# EAGLE design Phono-v1 (EAGLE 7.6.0)
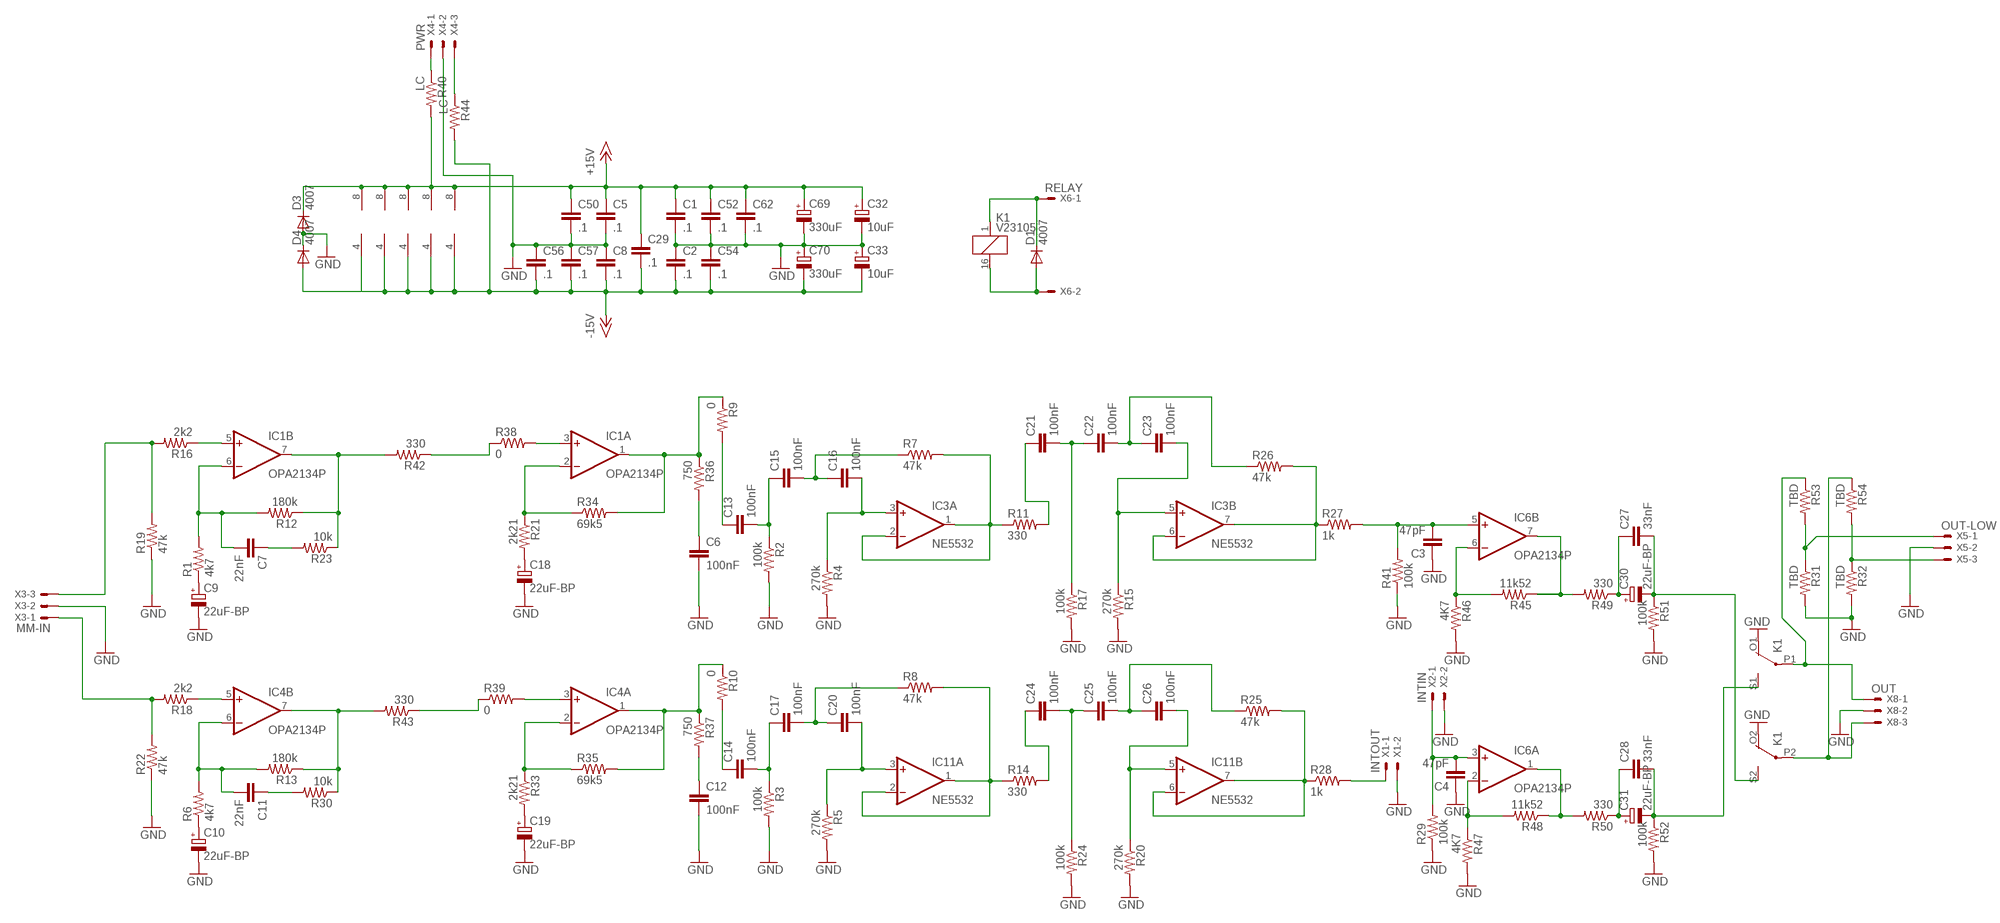
[diagram p0: schematic, sheet 1]

## Parts
C1  .1  C-EUC4532  [C4532]
C2  .1  C-EUC4532  [C4532]
C3  47pF  C-EUC1210  [C1210]
C4  47pF  C-EUC1210  [C1210]
C5  .1  C-EUC4532  [C4532]
C6  100nF  C-EU050-075X075  [C050-075X075]
C7  22nF  C-EU050-075X075  [C050-075X075]
C8  .1  C-EUC4532  [C4532]
C9  22uF-BP  CPOL-EUE5-10.5  [E5-10,5]
C10  22uF-BP  CPOL-EUE5-10.5  [E5-10,5]
C11  22nF  C-EU050-075X075  [C050-075X075]
C12  100nF  C-EU050-075X075  [C050-075X075]
C13  100nF  C-EU050-075X075  [C050-075X075]
C14  100nF  C-EU050-075X075  [C050-075X075]
C15  100nF  C-EU050-075X075  [C050-075X075]
C16  100nF  C-EU050-075X075  [C050-075X075]
C17  100nF  C-EU050-075X075  [C050-075X075]
C18  22uF-BP  CPOL-EUE5-10.5  [E5-10,5]
C19  22uF-BP  CPOL-EUE5-10.5  [E5-10,5]
C20  100nF  C-EU050-075X075  [C050-075X075]
C21  100nF  C-EU050-075X075  [C050-075X075]
C22  100nF  C-EU050-075X075  [C050-075X075]
C23  100nF  C-EU050-075X075  [C050-075X075]
C24  100nF  C-EU050-075X075  [C050-075X075]
C25  100nF  C-EU050-075X075  [C050-075X075]
C26  100nF  C-EU050-075X075  [C050-075X075]
C27  33nF  C-EU050-075X075  [C050-075X075]
C28  33nF  C-EU050-075X075  [C050-075X075]
C29  .1  C-EUC4532  [C4532]
C30  22uF-BP  CPOL-EUE5-10.5  [E5-10,5]
C31  22uF-BP  CPOL-EUE5-10.5  [E5-10,5]
C32  10uF  CPOL-EUE2-5  [E2-5]
C33  10uF  CPOL-EUE2-5  [E2-5]
C50  .1  C-EUC4532  [C4532]
C52  .1  C-EUC4532  [C4532]
C54  .1  C-EUC4532  [C4532]
C56  .1  C-EUC4532  [C4532]
C57  .1  C-EUC4532  [C4532]
C62  .1  C-EUC4532  [C4532]
C69  330uF  CPOL-EUE5-10.5  [E5-10,5]
C70  330uF  CPOL-EUE5-10.5  [E5-10,5]
D1  4007  1N4148DO35-7  [DO35-7]
D3  4007  1N4148DO35-10  [DO35-10]
D4  4007  1N4148DO35-10  [DO35-10]
IC1  OPA2134P  [DIL08]
IC3  NE5532  OPA2134P  [DIL08]
IC4  OPA2134P  [DIL08]
IC6  OPA2134P  [DIL08]
IC11  NE5532  OPA2134P  [DIL08]
K1  V23105  351  [351]
R1  4k7  R-US_0309/10  [0309/10]
R2  100k  R-US_0309/10  [0309/10]
R3  100k  R-US_0309/10  [0309/10]
R4  270k  R-US_0309/10  [0309/10]
R5  270k  R-US_0309/10  [0309/10]
R6  4k7  R-US_0309/10  [0309/10]
R7  47k  R-US_0309/10  [0309/10]
R8  47k  R-US_0309/10  [0309/10]
R9  0  R-US_0309/10  [0309/10]
R10  0  R-US_0309/12  [0309/12]
R11  330  R-US_0309/10  [0309/10]
R12  180k  R-US_0309/10  [0309/10]
R13  180k  R-US_0309/10  [0309/10]
R14  330  R-US_0309/10  [0309/10]
R15  270k  R-US_0309/10  [0309/10]
R16  2k2  R-US_0309/10  [0309/10]
R17  100k  R-US_0309/10  [0309/10]
R18  2k2  R-US_0309/10  [0309/10]
R19  47k  R-US_0309/10  [0309/10]
R20  270k  R-US_0309/10  [0309/10]
R21  2k21  R-US_0309/10  [0309/10]
R22  47k  R-US_0309/10  [0309/10]
R23  10k  R-US_0309/10  [0309/10]
R24  100k  R-US_0309/10  [0309/10]
R25  47k  R-US_0309/10  [0309/10]
R26  47k  R-US_0309/10  [0309/10]
R27  1k  R-US_0309/10  [0309/10]
R28  1k  R-US_0309/12  [0309/12]
R29  100k  R-US_0309/10  [0309/10]
R30  10k  R-US_0309/10  [0309/10]
R31  TBD  R-US_0309/10  [0309/10]
R32  TBD  R-US_0309/10  [0309/10]
R33  2k21  R-US_0309/10  [0309/10]
R34  69k5  R-US_0309/10  [0309/10]
R35  69k5  R-US_0309/10  [0309/10]
R36  750  R-US_0309/10  [0309/10]
R37  750  R-US_0309/10  [0309/10]
R38  0  R-US_0207/7  [0207/7]
R39  0  R-US_0204/7  [0204/7]
R40  LC  R-US_0309/12  [0309/12]
R41  100k  R-US_0309/10  [0309/10]
R42  330  R-US_0309/10  [0309/10]
R43  330  R-US_0309/10  [0309/10]
R44  LC  R-US_0309/12  [0309/12]
R45  11k52  R-US_0309/10  [0309/10]
R46  4K7  R-US_0309/10  [0309/10]
R47  4K7  R-US_0309/10  [0309/10]
R48  11k52  R-US_0309/10  [0309/10]
R49  330  R-US_0309/10  [0309/10]
R50  330  R-US_0309/10  [0309/10]
R51  100k  R-US_0309/10  [0309/10]
R52  100k  R-US_0309/10  [0309/10]
R53  TBD  R-US_0309/10  [0309/10]
R54  TBD  R-US_0309/10  [0309/10]
X1  INTOUT  22-23-2021  [22-23-2021]
X2  INTIN  22-23-2021  [22-23-2021]
X3  MM-IN  22-23-2031  [22-23-2031]
X4  PWR  22-23-2031  [22-23-2031]
X5  OUT-LOW  22-23-2031  [22-23-2031]
X6  RELAY  22-23-2021  [22-23-2021]
X8  OUT  22-23-2031  [22-23-2031]

## Nets
+15V: C1.1 C5.1 C29.1 C32.+ C50.1 C52.1 C62.1 C69.+ D3.C IC1.8(P:V+) IC3.8(P:V+) IC4.8(P:V+) IC6.8(P:V+) IC11.8(P:V+) R40.2
-15V: C2.2 C8.2 C29.2 C33.- C54.2 C56.2 C57.2 C70.- D4.A IC1.4(P:V-) IC3.4(P:V-) IC4.4(P:V-) IC6.4(P:V-) IC11.4(P:V-) R44.2
GND: C1.2 C2.1 C3.1 C4.1 C5.2 C6.2 C8.1 C9.- C10.- C12.2 C18.- C19.- C32.- C33.+ C50.2 C52.2 C54.1 C56.1 C57.1 C62.2 C69.- C70.+ D3.A D4.C K1.O1(2:O) K1.O2(3:O) R2.2 R3.2 R4.2 R5.2 R15.2 R17.2 R19.1 R20.2 R22.1 R24.2 R29.1 R31.2 R32.2 R41.1 R46.2 R47.2 R51.2 R52.2 X1.2 X2.2 X3.2 X4.2 X5.2 X8.2
N$1: C13.2 C15.1 R2.1
N$2: C14.2 C17.1 R3.1
N$3: R31.1 R53.2 X5.1
N$4: C13.1 R9.2
N$5: C14.1 R10.2
N$6: IC3.6(B:-IN) IC3.7(B:OUT) R26.2 R27.1
N$7: IC11.1(A:OUT) IC11.2(A:-IN) R8.2 R14.1
N$8: IC11.6(B:-IN) IC11.7(B:OUT) R25.2 R28.1
N$9: C26.2 IC11.5(B:+IN) R20.1
N$10: R39.1 R43.1
N$11: R38.1 R42.1
N$12: C23.2 IC3.5(B:+IN) R15.1
N$13: C16.2 IC3.3(A:+IN) R4.1
N$14: IC1.5(B:+IN) R16.1
N$15: C17.2 C20.1 R8.1
N$16: C21.1 R11.2
N$17: C15.2 C16.1 R7.1
N$18: IC4.5(B:+IN) R18.1
N$19: IC1.7(B:OUT) R12.1 R23.1 R42.2
N$20: IC4.7(B:OUT) R13.1 R30.1 R43.2
N$21: C11.2 IC4.6(B:-IN) R6.2 R13.2
N$22: C7.2 IC1.6(B:-IN) R1.2 R12.2
N$23: R18.2 R22.2 X3.1
N$24: C20.2 IC11.3(A:+IN) R5.1
N$25: C24.1 R14.2
N$26: C21.2 C22.1 R17.1
N$27: C22.2 C23.1 R26.1
N$28: C24.2 C25.1 R24.1
N$29: R16.2 R19.2 X3.3
N$30: IC1.2(A:-IN) R21.1 R34.1
N$31: IC4.2(A:-IN) R33.1 R35.1
N$32: K1.P2(3:P) R54.1 X8.3
N$33: K1.P1(2:P) R53.1 X8.1
N$34: C7.1 R23.2
N$36: C9.+ R1.1
N$37: IC1.3(A:+IN) R38.2
N$38: IC1.1(A:OUT) R9.1 R34.2 R36.1
N$39: D1.A K1.16 X6.2
N$40: D1.C K1.1 X6.1
N$41: IC4.1(A:OUT) R10.1 R35.2 R37.1
N$42: C6.1 R36.2
N$43: C12.1 R37.2
N$44: C18.+ R21.2
N$45: C19.+ R33.2
N$46: IC4.3(A:+IN) R39.2
N$47: C10.+ R6.1
N$48: C25.2 C26.1 R25.1
N$49: IC3.1(A:OUT) IC3.2(A:-IN) R7.2 R11.1
N$50: C11.1 R30.2
N$51: C3.2 IC6.5(B:+IN) R27.2 R41.2
N$52: R28.2 X1.1
N$53: C4.2 IC6.3(A:+IN) R29.2 X2.1
N$54: R40.1 X4.1
N$55: R44.1 X4.3
N$56: IC6.6(B:-IN) R45.2 R46.1
N$57: C28.2 C31.- K1.S1(2:S) R52.1
N$58: C27.1 C30.+ R49.1
N$59: IC6.2(A:-IN) R47.1 R48.2
N$60: C28.1 C31.+ R50.1
N$61: C27.2 C30.- K1.S2(3:S) R51.1
N$62: IC6.7(B:OUT) R45.1 R49.2
N$63: IC6.1(A:OUT) R48.1 R50.2
N$64: R32.1 R54.2 X5.3

## Library data of the parts
C1-C8 C11-C17 C20-C29 C50 C52 C54 C56 C57 C62 = resistor:C-EU: CAPACITOR, European symbol
C9 C10 C18 C19 C30-C33 C69 C70 = resistor:CPOL-EU: POLARIZED CAPACITOR, European symbol
D1 D3 D4 = diode:1N4148: DIODE high speed (Philips)
IC1 IC3 IC4 IC6 IC11 = linear:OPA2134: SoundPLUS (TM) High Performance AUDIO OPERATIONAL AMPLIFIERS Source: http://focus.ti.com/lit/ds/sbos058/sbos058.pdf
K1 = relay:351: RELAY 2 x switch, Omron; OC_FARNELL: unknown; OC_NEWARK: unknown
R1-R54 = resistor:R-US_: RESISTOR, American symbol
X1 X2 X6 = con-molex:22-23-2021: .100" (2.54mm) Center Header - 2 Pin; MF: MOLEX; MPN: 22-23-2021; OC_FARNELL: 1462926; OC_NEWARK: 25C3832
X3-X5 X8 = con-molex:22-23-2031: .100" (2.54mm) Center Header - 3 Pin; MF: MOLEX; MPN: 22-23-2031; OC_FARNELL: 1462950; OC_NEWARK: 30C0862

## Board
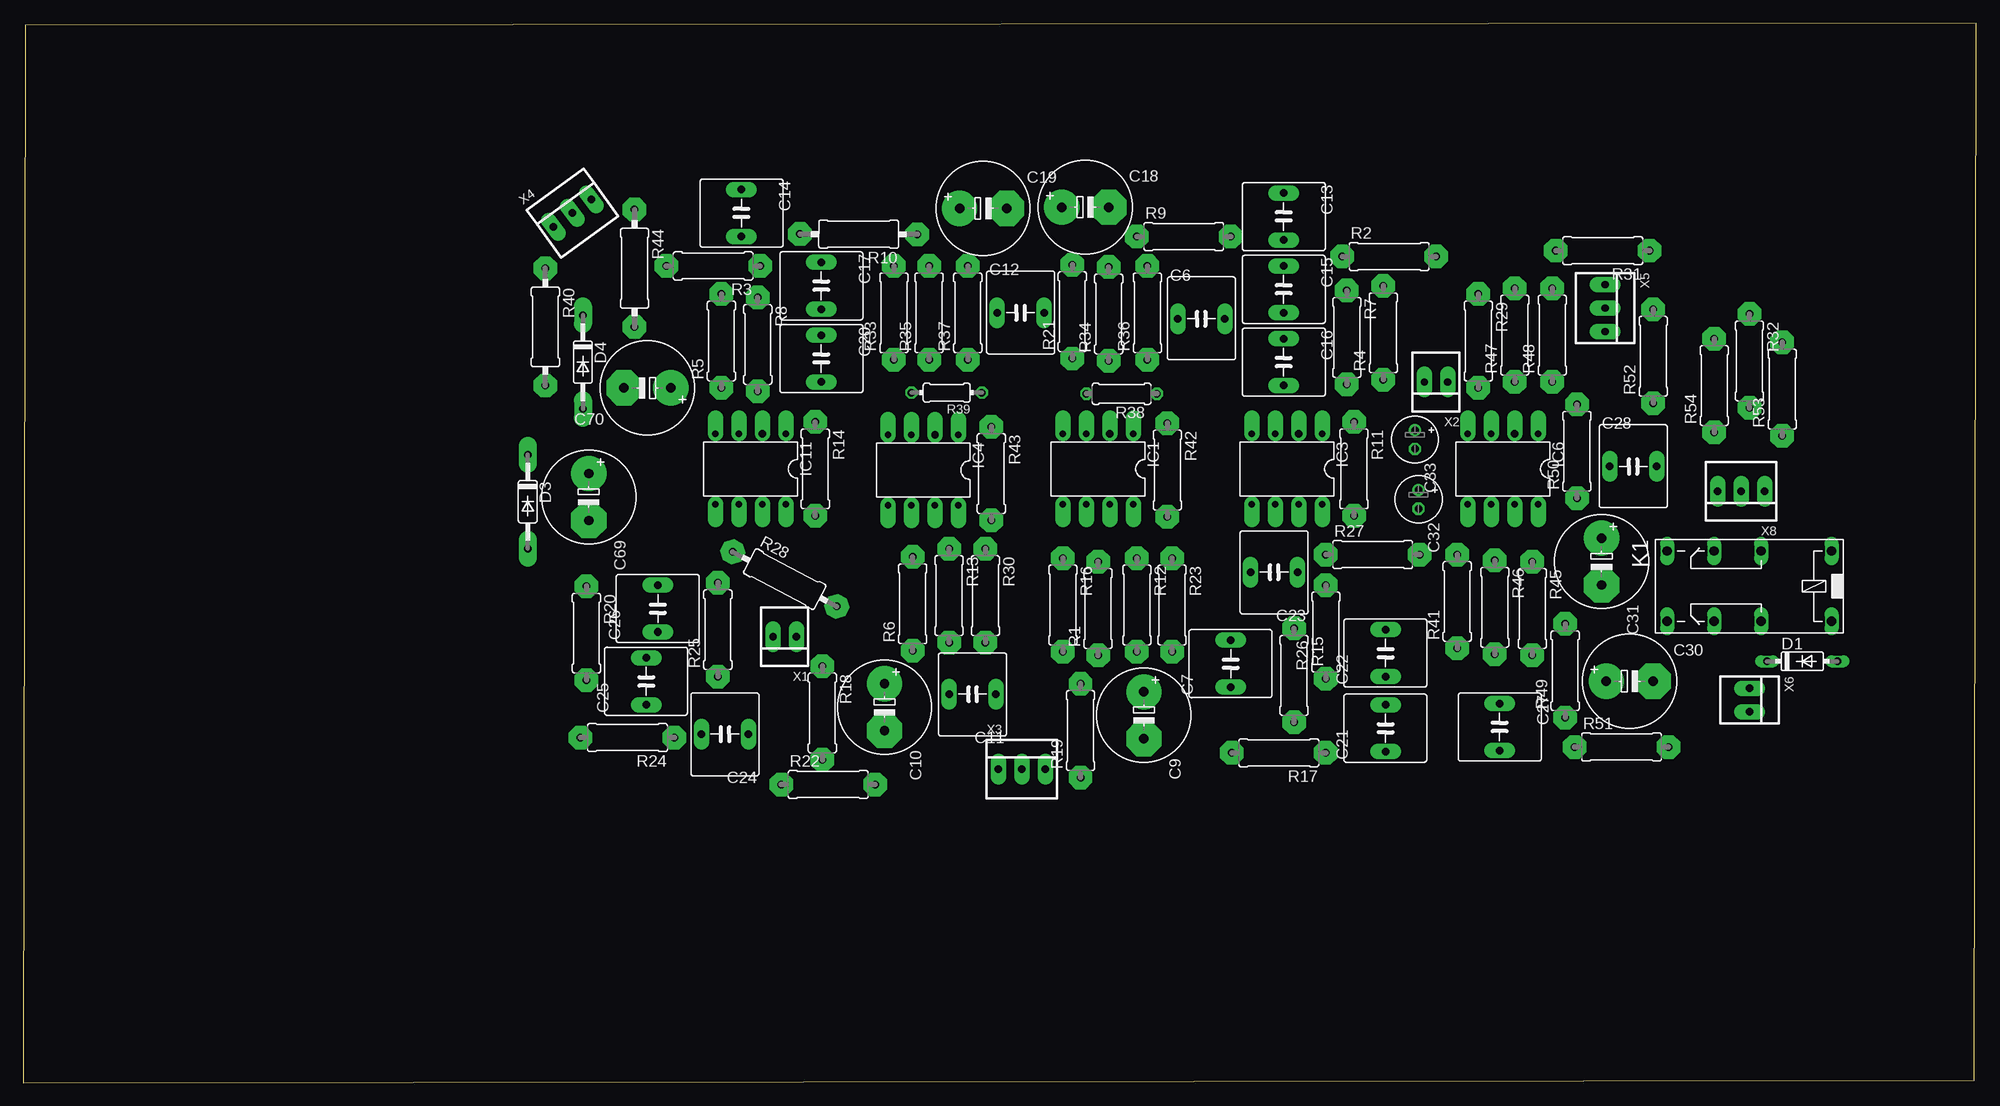
[diagram p1: board, top side]
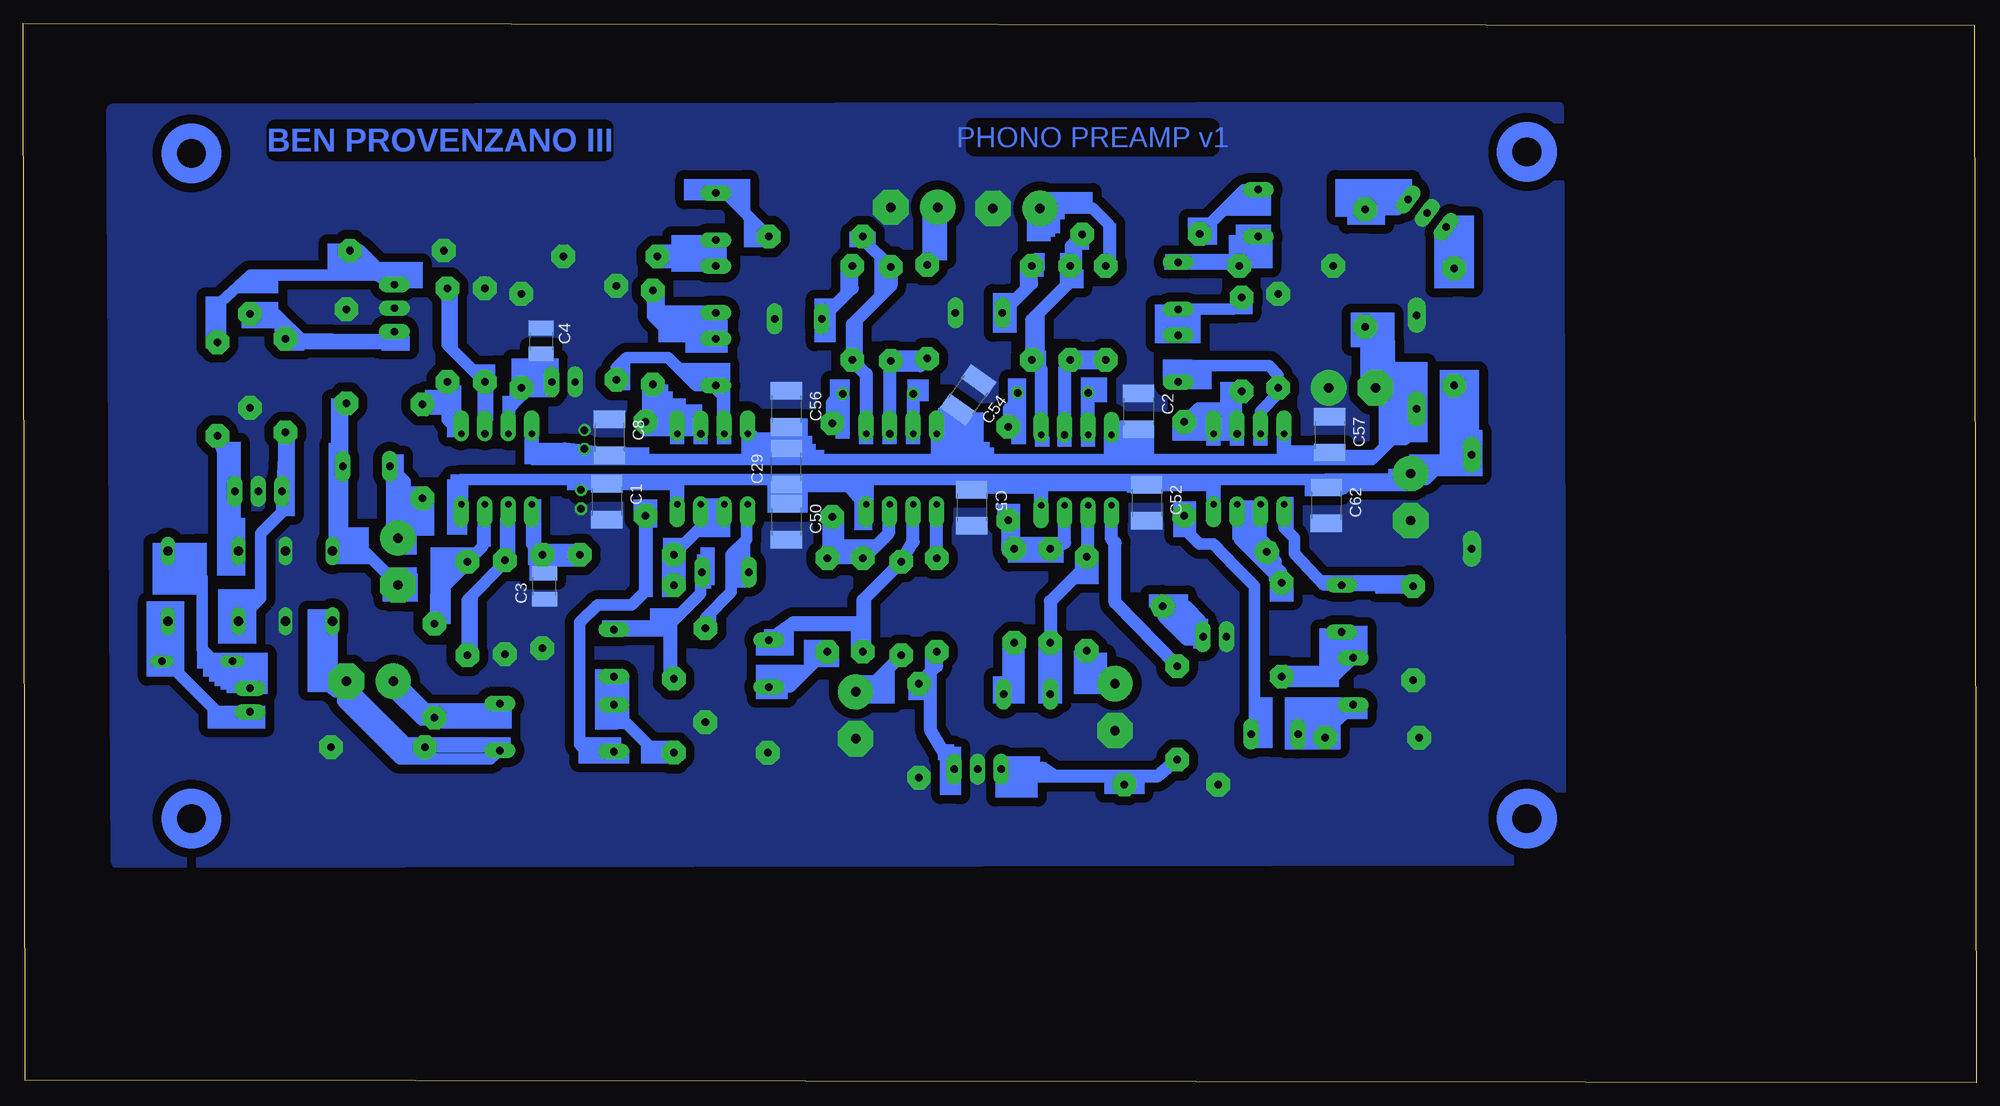
[diagram p2: board, bottom side, seen from below]

Size 211.38 x 114.67 mm. Coordinates in mm from the lower left corner, seen from the top.
Outline: 0,0 211.12,0.25 211.38,114.67 0.25,114.42 0,0
Copper layers (1*16): Top 0.035mm / dielectric 1.5mm / Bottom 0.035mm
Design rules "default": minimum track width 10mil, minimum drill 24mil, track to track 8mil, track to pad 8mil, pad to pad 8mil, via to via 8mil, smd to smd 8mil, copper to edge 40mil, drill to drill 8mil, minimum pad ring 10mil, minimum via ring 8mil, stop-mask expansion 5mil, vias tented up to drill 0mil, thermal gap 10mil

### Footprints (pad centres in the part's own frame; a part is rotated, then mirrored left to right if it is on the bottom)
C4532 = smd 1.9 x 3.4: 1 -1.95,0; 2 1.95,0
C1210 = smd 1.6 x 2.7: 1 -1.4,0; 2 1.4,0
C050-075X075 = drill 0.813 pad 1.676 long: 1 -2.54,0; 2 2.54,0
E5-10,5 = drill 1.016 pad 3.81: + -2.54,0 | drill 1.016 pad 3.81 octagon: - 2.54,0
E2-5 = drill 0.813 pad 1.27: + -1.016,0 | drill 0.813 pad 1.27 octagon: - 1.016,0
DO35-7 = drill 0.813 long: A 3.81,0; C -3.81,0
DO35-10 = drill 0.813 pad 1.93 long: A 5.08,0; C -5.08,0
DIL08 = drill 0.7 pad 1.676 offset: 1 -3.81,-3.81; 3 1.27,-3.81; 4 3.81,-3.81; 5 3.81,3.81; 6 1.27,3.81; 7 -1.27,3.81; 8 -3.81,3.81 | drill 0.8 pad 1.676 offset: 2 -1.27,-3.81
351 = drill 1.016 long: 1 -3.81,-3.81; 16 -3.81,3.81; O1 8.89,-3.81; O2 8.89,3.81; P1 3.81,-3.81; P2 3.81,3.81; S1 13.97,-3.81; S2 13.97,3.81
0309/10 = drill 0.813 pad 2.54 octagon: 1 -5.08,0; 2 5.08,0
0309/12 = drill 0.813 pad 2.54 octagon: 1 -6.35,0; 2 6.35,0
0207/7 = drill 0.813 octagon: 1 -3.81,0; 2 3.81,0
0204/7 = drill 0.813 octagon: 1 -3.81,0; 2 3.81,0
22-23-2021 = drill 0.8 pad 1.676 long: 1 -1.27,0; 2 1.27,0
22-23-2031 = drill 0.8 pad 1.676 long: 1 -2.54,0; 2 0,0; 3 2.54,0

### Placement (x,y rotation side)
C1  148.21,62.87 270 bottom
C2  90.68,72.64 270 bottom
C3  154.94,53.72 90 bottom
C4  155.32,80.26 270 bottom
C5  108.71,62.23 270.2 bottom
C6  127.51,82.68 0 top
C7  130.68,45.34 90 top
C8  147.95,69.85 270 bottom
C9  121.28,39.75 270 top
C10  93.22,40.64 270 top
C11  102.74,42.04 180 top
C12  107.95,83.31 0 top
C13  136.4,93.73 270 top
C14  77.72,94.11 270 top
C15  136.4,85.85 270 top
C16  136.4,77.98 270 top
C17  86.36,86.23 270 top
C18  114.94,94.74 0 top
C19  103.89,94.61 0 top
C20  86.36,78.36 270 top
C21  147.45,38.35 90 top
C22  147.45,46.48 90 top
C23  135.38,55.24 180 top
C24  75.95,37.72 180 top
C25  67.44,43.43 90 top
C26  68.71,51.31 90 top
C27  159.77,38.48 270 top
C28  174.24,66.67 0 top
C29  128.78,66.67 90 bottom
C30  173.86,43.43 0 top
C31  170.81,56.39 270 top
C32  151,63.12 270 top
C33  150.62,69.6 270 top
C50  128.78,60.71 270 bottom
C52  89.79,62.74 270 bottom
C54  109.09,74.42 234.6 bottom
C56  128.78,72.9 270 bottom
C57  69.98,70.1 270 bottom
C62  70.36,62.48 270 bottom
C69  61.21,63.37 270 top
C70  67.56,75.18 180 top
D1  192.53,45.59 0 top
D3  54.61,62.87 270 top
D4  60.58,77.98 270 top
IC1  116.33,66.42 180 top
IC3  136.78,66.42 180 top
IC4  97.41,66.29 180 top
IC6  160.15,66.42 180 top
IC11  78.74,66.42 180 top
K1  191.9,53.72 180 top
R1  116.33,51.31 90 top
R2  147.83,89.41 0 top
R3  74.68,88.39 180 top
R4  147.19,81.15 90 top
R5  75.56,80.26 90 top
R6  96.27,51.82 90 top
R7  143.26,80.64 270 top
R8  79.5,79.88 270 top
R9  125.6,91.57 0 top
R10  90.42,91.82 179.9 top
R11  144.02,66.42 270 top
R12  120.52,51.69 270 top
R13  100.2,52.7 270 top
R14  85.72,66.42 270 top
R15  137.54,44.07 270 top
R16  112.52,51.69 270 top
R17  135.89,35.69 180 top
R18  86.49,40 270 top
R19  114.43,38.1 90 top
R20  60.96,48.64 270 top
R21  113.54,83.44 90 top
R22  87.12,32.26 0 top
R23  124.33,51.69 270 top
R24  65.41,37.34 180 top
R25  75.18,49.02 90 top
R26  140.97,48.77 90 top
R27  146.05,57.15 0 top
R28  82.42,54.48 332.3 top
R29  157.48,80.26 270 top
R30  104.14,52.7 270 top
R31  170.94,90.04 180 top
R32  186.82,78.11 270 top
R33  94.23,83.31 90 top
R34  117.47,83.19 90 top
R35  98.04,83.31 90 top
R36  121.67,83.31 90 top
R37  102.23,83.31 90 top
R38  118.87,74.55 180 top
R39  99.95,74.68 180 top
R40  56.52,81.79 270 top
R41  155.19,52.07 90 top
R42  123.82,66.29 270 top
R43  104.78,65.91 270 top
R44  66.17,88.14 270 top
R45  163.32,51.31 270 top
R46  159.26,51.44 270 top
R47  161.42,80.9 90 top
R48  165.48,80.9 90 top
R49  166.88,44.58 90 top
R50  168.15,68.33 90 top
R51  172.97,36.32 0 top
R52  176.4,78.61 90 top
R53  190.37,75.06 90 top
R54  183.01,75.44 90 top
X1  82.42,48.26 180 top
X2  152.91,75.82 180 top
X3  108.08,33.91 0 top
X4  59.44,94.11 36 top
X5  171.2,83.82 270 top
X6  186.82,41.4 270 top
X8  185.93,64.01 180 top

### Tracks (layer width: path | path; a pad name or v marks a point on that pad's centre or on a via)
+15V
  Bottom 0.406: IC6.8 163.96,65.28
  Bottom 1.016: IC3.8 140.59,65.15 | 68.62,64.43 69.34,64.64 69.34,65.28 | IC11.8 82.55,65.15 | C52.1 90.38,65.28 91.44,65.28
  Bottom 1.27: 101.35,65.28 108.84,65.28 | 108.84,65.28 120.14,65.28 | 120.14,65.28 140.72,65.28 | 140.72,65.28 152.78,65.28 | 152.78,65.28 163.96,65.28 | 140.59,65.15 140.72,65.28 | 101.35,65.28 101.22,65.15 IC4.8 | 82.55,65.15 82.42,65.28 | 101.35,65.28 91.44,65.28 82.42,65.28 | 82.42,65.28 69.34,65.28 68.96,65.28 | 120.14,64.64 120.14,65.28 | C5.1 108.84,64.95 108.84,65.28 | C1.1 150.96,65.09 | 150.96,65.09 152.78,65.28 | 68.62,64.43 67.78,65.28 60.96,65.28 | 60.96,65.28 59.56,65.28 56.52,68.33 | 56.52,68.33 R40.2 | D3.C 54.99,68.33 56.52,68.33 | C69.+ 60.96,65.91 60.96,65.28 | C32.+ 150.96,64.18 150.96,65.09
  Bottom 1.676: 68.62,64.43 C62.1 | C50.1 C29.1 122,64.72 IC1.8 120.14,64.64
-15V
  Bottom 0.406: 156.34,70.1 156.26,68.43 156.21,67.44
  Bottom 1.016: IC11.4 74.93,67.56
  Bottom 1.27: 69.98,67.44 74.8,67.44 74.93,67.56 | 92.07,67.44 112.52,67.44 | 112.52,67.44 132.84,67.44 | 132.84,67.44 156.21,67.44 | 132.97,67.56 132.84,67.44 | C57.2 69.98,67.44 | 92.07,67.44 91.95,67.56 91.95,68.33 | 112.52,67.44 IC1.4 112.52,72.05 C54.2 | IC11.4 74.93,67.44 92.07,67.44 | D4.A 60.58,70.87 61.85,69.6 63.25,69.6 63.44,69.41 | 63.44,69.41 65.41,67.44 69.98,67.44 | 63.44,69.41 63.44,73.6 C70.- 63.5,76.71 63.5,80.14 65.15,81.79 R44.2 | C33.- 150.87,68.33 151.89,68.33
  Bottom 1.422: IC3.4 132.97,67.56
  Bottom 1.676: IC4.4 93.6,69.47 | 93.6,69.47 93.6,68.07 92.63,69.04 C2.2 | 156.34,70.1 IC6.4 156.34,71.37 | C56.2 C29.2 128.78,68.58 129.29,68.07 130.56,68.07 IC3.4 | 152.78,68.45 C8.2 151.89,68.33 152.8,68.43 156.26,68.43 | 91.95,68.33 92.46,68.33 93.6,69.47
GND
  pour Bottom (isolate 0.965, no thermals): 45.34,105.54 45.09,24.13 201.17,23.88 201.68,105.28
N$1
  Bottom 1.27: C15.1 136.4,89.41 | 136.4,89.41 C13.2 | R2.1 136.4,89.41
N$2
  Bottom 1.27: C14.2 80.52,88.77 | 80.52,88.77 C17.1 | R3.1 80.14,88.77 80.52,88.77
N$3
  Bottom 1.27: X5.1 172.02,87.19 | 172.02,87.19 175.01,90.17 176.66,90.17 176.53,90.04 R31.1 | R53.2 189.99,79.88 189.99,84.45 186.82,87.38 172.97,87.38 172.78,87.19 172.02,87.19
N$4
  Bottom 1.27: R9.2 135.38,96.27 C13.1
N$5
  Bottom 1.27: 77.85,96.52 C14.1 79.26,96.65 R10.2
N$6
  Bottom 1.27: R26.2 R27.1 136.53,61.59 136.53,62.61 | IC3.6 136.53,62.61 | 136.53,62.61 IC3.7
N$7
  Bottom 1.27: IC11.1 81.28,70.23 | 81.28,70.23 IC11.2 | R8.2 81.28,73.03 | 81.28,73.03 81.28,70.23 | R14.1 84.2,73.03 81.28,73.03
N$8
  Bottom 1.27: IC11.6 78.61,61.47 | 78.61,61.47 78.61,59.18 77.22,57.78 R28.1 75.82,56.45 75.82,54.36 75.95,54.48 75.95,54.99 79.76,58.8 79.76,59.18 79.38,58.8 77.34,58.8 76.07,57.53 76.07,56.13 75.18,55.24 R25.2 | IC11.7 78.87,61.47 78.61,61.47
N$9
  Bottom 1.27: R20.1 61.09,53.85 C26.2 70.61,53.85 73.79,57.28 73.79,58.93 74.93,60.07 IC11.5
N$10
  Bottom 1.422: R43.1 104.65,71.12 104.65,72.9 103.63,73.91 R39.1
N$11
  Bottom 1.422: R38.1 123.82,73.53 R42.1
N$12
  Bottom 1.27: IC3.5 133.1,62.48 133.1,58.8 134.75,57.15 134.75,55.24 | 134.75,55.24 134.75,53.09 137.54,50.29 R15.1 | C23.2 134.75,55.24
N$13
  Bottom 1.27: IC3.3 135.51,74.17 136.84,75.5 136.46,75.5 C16.2 138.56,75.44 141.6,78.49 146.05,78.49 147.19,77.34 R4.1
N$14
  Bottom 1.422: R16.1 IC1.5
N$15
  Bottom 1.27: R8.1 80.39,83.69 C17.2 C20.1
N$16
  Bottom 1.27: R11.2 144.15,61.21 144.15,53.09 145.54,51.69 149.22,51.69 151.13,49.78 151.13,36.58 150.37,35.81 C21.1
N$17
  Bottom 1.27: C16.1 C15.2 138.05,81.66 141.99,81.66 143.26,82.93 R7.1
N$18
  Bottom 1.422: R18.1 93.22,51.94 93.22,58.42 93.6,58.8 IC4.5
N$19
  Bottom 1.422: IC1.7 117.73,62.48 117.73,59.44 120.4,56.77 R12.1 121.41,56.77 | 121.41,56.77 R23.1 | R42.2 123.57,60.96 123.57,58.93 121.41,56.77
N$20
  Bottom 1.422: R43.2 104.78,57.53 R30.1 R13.1 98.68,58.42 IC4.7
N$21
  Bottom 1.422: C11.2 R13.2 100.2,52.07 96.77,55.5 96.77,56.39 R6.2 96.14,57.02 IC4.6
N$22
  Bottom 1.422: IC1.6 115.06,58.55 R1.2 120.52,52.2 120.52,49.78 | 120.52,49.78 R12.2 | C7.2 128.02,49.78 120.52,49.78
N$23
  Bottom 1.27: R22.2 91.31,33.15 89.79,33.15
  Bottom 1.422: 104.52,34.16 X3.1 101.09,34.04 99.69,33.15 89.79,33.15 88.65,33.15 R18.2
N$24
  Bottom 1.27: IC11.3 77.47,72.64 75.56,74.55 R5.1 75.56,76.58 76.58,77.6 84.58,77.6 C20.2
N$25
  Bottom 1.27: R14.2 85.6,61.21 85.6,59.82 84.07,58.29 82.55,58.29 80.26,55.88 | 80.39,56.01 80.26,55.88 | 80.26,55.88 78.1,53.72 78.1,38.1 C24.1
N$26
  Bottom 1.27: C22.1 C21.2 147.45,38.99 147.32,38.86 146.05,38.86 142.88,35.69 R17.1
N$27
  Bottom 1.27: C23.1 138.05,55.12 138.05,52.96 141.48,49.53 | 141.48,49.53 141.99,49.02 C22.2 | R26.1 141.48,44.2 141.48,49.53
N$28
  Bottom 1.27: C25.1 70.1,38.23 73.28,38.23 73.09,38.04 | 73.09,38.04 72.39,37.34 R24.1 | C24.2 73.41,37.59 73.09,37.91 73.09,38.04
N$29
  Bottom 1.422: R19.2 113.16,44.45 | 113.16,44.45 112.52,45.09 R16.2 | X3.3 113.16,38.1 113.16,44.45
N$30
  Bottom 1.422: R34.1 117.6,77.98 117.6,77.6 | 117.6,77.6 IC1.2 | R21.1 114.3,77.6 117.6,77.6
N$31
  Bottom 1.422: R33.1 R35.1 98.68,77.34 IC4.2
N$32
  Bottom 1.27: R54.1 X8.3 183.39,61.72 185.67,59.44 185.67,52.45 188.09,50.04 K1.P2
N$33
  Bottom 1.27: R53.1 X8.1 188.47,58.55 188.09,58.17 K1.P1
N$34
  Bottom 1.27: C7.1 128.4,42.8 125.22,45.97 125.22,46.61
  Bottom 1.422: 126.11,46.61 125.22,46.61 R23.2
N$36
  Bottom 1.422: R1.1 120.27,42.29 C9.+
N$37
  Bottom 1.422: R38.2 IC1.3
N$38
  Bottom 1.27: R34.2 120.52,91.31 R9.1
  Bottom 1.422: IC1.1 120.14,76.71 R36.1 121.67,82.04 117.47,86.23 R34.2
N$39
  Bottom 1.27: X6.2 186.94,40 190.25,40 195.71,45.47 | 195.71,45.47 K1.16 | D1.A 196.22,45.47 195.71,45.47
N$40
  Bottom 1.27: X6.1 187.07,42.93 187.07,44.83 187.83,45.59 D1.C 188.85,45.72 190.88,45.72 192.02,46.86 192.02,54.61 194.94,57.53 K1.1
N$41
  Bottom 1.27: R10.1 98.04,90.54 R35.2
  Bottom 1.422: R35.2 98.43,87.76 98.43,86.36 102.23,82.55 R37.1 101.22,77.22 IC4.1
N$42
  Bottom 1.422: C6.1 121.67,85.98 R36.2
N$43
  Bottom 1.422: C12.1 102.23,86.49 R37.2
N$44
  Bottom 1.27: C18.+ R21.2
N$45
  Bottom 1.27: R33.2 93.85,88.77 93.85,92.84 95.63,94.61 C19.+
N$46
  Bottom 1.422: IC4.3 96.01,70.23 R39.2
N$47
  Bottom 1.422: C10.+ 96.27,46.23 R6.1
N$48
  Bottom 1.27: R25.1 69.47,43.94 C25.2 68.71,47.24 C26.1
N$49
  Bottom 1.27: IC3.2 139.32,71.5 140.46,71.5 140.59,71.37 IC3.1 140.97,70.61 140.97,71.75 141.6,72.39 142.24,72.52 | 142.24,72.52 143.26,73.53 R7.2 | R11.1 143,72.52 142.24,72.52
N$50
  Bottom 1.422: C11.1 104.14,43.18 R30.2
N$51
  Bottom 1.27: R27.2 R41.2 | R41.2 156.34,58.29 IC6.5 | C3.2 155.19,55.38 R41.2
N$52
  Bottom 1.27: 86.96,51.53 87.34,51.53 | 87.34,51.53 R28.2 | X1.1 84.07,47.88 85.47,47.88 88.01,50.42 88.01,50.93 87.38,51.56 85.47,51.56 83.95,50.04 83.95,48.13 87.34,51.53
N$53
  Bottom 1.27: IC6.3 158.75,70.36 158.75,73.03 157.86,73.91 | 157.86,73.91 155.96,75.82 155.45,75.82 | 155.45,75.82 X2.1 | R29.2 158.11,73.91 157.86,73.91 | C4.2 155.45,78.74 155.45,75.82
N$54
  Bottom 1.27: X4.1 56.52,91.75 R40.1
N$55
  Bottom 1.27: X4.3 62.6,94.49 R44.1
N$56
  Bottom 1.27: IC6.6 158.75,62.48 158.75,56.64 158.88,56.52 R46.1 159.26,56.26 163.32,52.2 R45.2
N$57
  Bottom 1.27: C31.- 174.5,57.53 K1.S1 176.78,58.67 C28.2 176.78,73.15 R52.1
N$58
  Bottom 1.27: C30.+ 170.81,43.43 170.81,43.18 166.88,39.24 168.28,39.24 171.32,42.29 170.94,42.29 170.43,42.8 170.18,42.8 R49.1 162.31,39.5 C27.1
N$59
  Bottom 1.27: R48.2 165.48,79.88 R47.1 IC6.2
N$60
  Bottom 1.27: C31.+ 170.05,59.69 170.05,63.25 | 170.05,63.25 170.05,65.02 C28.1 | R50.1 170.05,63.25
N$61
  Bottom 1.27: R51.1 160.78,36.32 C27.2 160.78,35.05 170.56,35.05 176.78,41.27 176.78,43.05 | 175.51,42.29 177.93,42.55 K1.S2 | C30.- 176.78,43.05 | 176.78,43.05 177.55,42.29 175.51,42.29 | 175.51,42.29 169.42,36.2 169.42,35.94
N$62
  Bottom 1.27: R49.2 166.75,49.78 166.75,52.7 163.32,56.13 R45.1 161.67,58.04 161.67,59.94 161.42,60.2 IC6.7
N$63
  Bottom 1.27: IC6.1 165.48,71.75 165.48,72.9 | 165.48,72.9 R48.1 | R50.2 167.64,72.9 165.48,72.9
N$64
  Bottom 1.27: X5.3 172.59,80.39 R54.2 180.97,80.14 184.02,83.19 R32.1
(copper drawn outside any net)
  shapes: Bottom area x445, Bottom circle x4

### Text on the board
Bottom: PHONO PREAMP v1 | BEN PROVENZANO III